# Altium schematic sheet Display.SchDoc: Display
size A4; DrawnBy: Sindre Hovland; Organization: Advanced Wearables Nordic Semi; Revision: V1; SheetNumber: 4; SheetTotal: 4
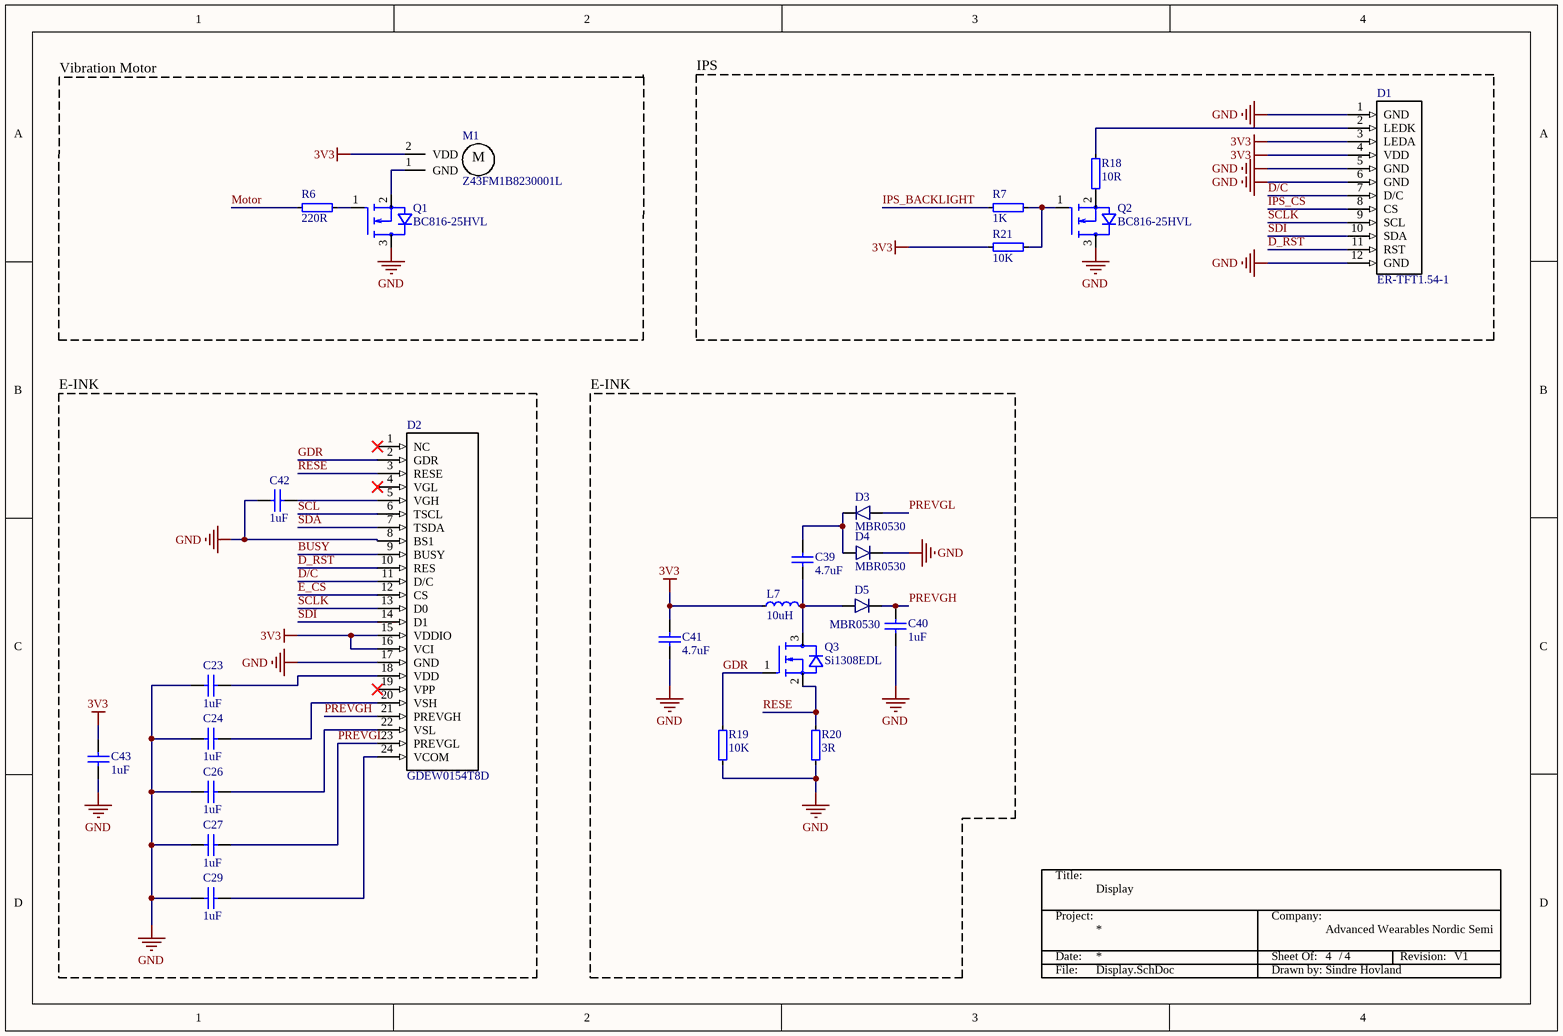
[diagram p0: Display.SchDoc]

## Parts
*  TitleBlock  (value not drawn)  (graphical)
C23  1uF  [C0402]
C24  1uF  [C0402]
C26  1uF  [C0402]
C27  1uF  [C0402]
C29  1uF  [C0402]
C39  4.7uF  [C0402]
C40  1uF  [C0402]
C41  4.7uF  [C0402]
C42  1uF  [C0402]
C43  1uF  [C0402]
D1  ER-TFT1.54-1  [IPS 1.54 inches]
D2  GDEW0154T8D  [E-Papaer 1.54inches]
D3  MBR0530  [SOD-123]
D4  MBR0530  [SOD-123]
D5  MBR0530  [SOD-123]
L7  10uH  [IND0402]
M1  Z43FM1B8230001L  [Z43FM1B8230001L]
Q1  BC816-25HVL  [SOT23-3]
Q2  BC816-25HVL  [SOT23-3]
Q3  Si1308EDL  [SOT323]
R6  220R  [RES0603R]
R7  1K  [RES0402]
R18  10R  [RES0402]
R19  10K  [RES0402]
R20  3R  [RES0402]
R21  10K  [RES0402]

## Blocks framed on the sheet
Vibration Motor: M1 Q1 R6
IPS: D1 Q2 R7 R18 R21
E-INK: C23 C24 C26 C27 C29 C42 C43 D2
E-INK: C39-C41 D3-D5 L7 Q3 R19 R20

## Nets
3V3: C41.1 C43.1 D1.3(LEDA) D1.4(VDD) D2.15(VDDIO) D2.16(VCI) L7.1 M1.2(VDD) R21.1
GND: C23.2 C24.2 C26.2 C27.2 C29.2 C40.2 C41.2 C42.1 C43.2 D1.1(GND) D1.5(GND) D1.6(GND) D1.12(GND) D2.8(BS1) D2.17(GND) D4.2(C) Q1.3(D) Q2.3(D) R19.1 R20.1
BUSY: D2.9(BUSY)
D/C: D1.7(D/C) D2.11(D/C)
D_RST: D1.11(RST) D2.10(RES)
E_CS: D2.12(CS)
GDR: D2.2(GDR) Q3.1(G) R19.2
IPS_BACKLIGHT: R7.1
IPS_CS: D1.8(CS)
Motor: R6.1
PREVGH: C40.1 D2.21(PREVGH) D5.2(C)
PREVGL: C27.1 D2.23(PREVGL) D3.1(A)
RESE: D2.3(RESE) Q3.2(S) R20.2
SCL: D2.6(TSCL)
SCLK: D1.9(SCL) D2.13(D0)
SDA: D2.7(TSDA)
SDI: D1.10(SDA) D2.14(D1)
NetC23_1: C23.1 D2.18(VDD)
NetC24_1: C24.1 D2.20(VSH)
NetC26_1: C26.1 D2.22(VSL)
NetC29_1: C29.1 D2.24(VCOM)
NetC39_1: C39.1 D3.2(C) D4.1(A)
NetC39_2: C39.2 D5.1(A) L7.2 Q3.3(D)
NetC42_2: C42.2 D2.5(VGH)
NetD1_2: D1.2(LEDK) R18.2
NetM1_1: M1.1(GND) Q1.2(S)
NetQ1_1: Q1.1(G) R6.2
NetQ2_1: Q2.1(G) R7.2 R21.2
NetQ2_2: Q2.2(S) R18.1

Not connected (* = marked no-connect by the designer): D2 1(NC)* 4(VGL)* 19(VPP)*

## Notes on the sheet
- (in symbol TitleBlock) Title:; Project:; Company:; Date:; Sheet Of:; /; Revision:; File:; Drawn by:
- (in symbol Vibration Motor) M

## Library data of the parts
C23 C24 C26 C27 C29 C39-C43 = CAP: Capacitor; Value: 100pF; Published: 8-Jun-2000; Revision: July-2002: Re-released for DXP Platform.; Publisher: Altium Limited
D1 = IPS 1.54 inch: IPS display 1.54 inch SPI
D2 = E-Paper 1.54 inch: E-Paper 1.54 inch with integrated driver
D3-D5 = Diode: Switch-mode Schottky / Power Rectifier / 250 V, 40 A
L7 = IND: Inductor; Part Number: FB0402-120R@100M-500mA; Manufacturer: Murata; Manufacturer Part Number: BLM15AG121SN1D; Part number IPS: N.A.; Value: 120R/0.55A; Note: Chip EMIFIL Inductor Type Chip Ferrite Bead; Artikkelnr Noca: 33029317; Footprint Doc: 0402; LatestRevisionDate: 2014-01-10; Pin Count: 2; Publisher: Nordic Semiconductor; Published: 2011-11-14; ComponentLink1URL: *; ComponentLink1Description: Datasheet; ComponentLink2URL: *; ComponentLink2Description: Supplier link; HelpURL: http://search.murata.co.jp/Ceramy/image/img/PDF/ENG/L0110S0100BLM15A_SN.pdf
M1 = Vibration Motor: SMD Vibration Motor / https://www.vibration-motor.com/cylindrical-vibrator-motors/smt-surface-mount-reflow/z43fm1b8230001l; ComponentLink1Description: Manufacturer; ComponentLink1URL: https://www.vibration-motor.com/cylindrical-vibrator-motors/smt-surface-mount-reflow/z43fm1b8230001l
Q1-Q3 = Transistor: N-Channel 20V 100mA _Ta_ 150mW _Ta_ Surface Mount VMT3; MF: Rohm; MP: RUM001L02T2CL; Value: *; SnapEDA_Link: https://www.snapeda.com/parts/RUM001L02T2CL/Rohm/view-part/531428/?ref=snap; Digi-Key_Part_Number: RUM001L02T2CLCT-ND; Digi-Key_Purchase_URL: https://www.digikey.com/product-detail/en/rohm-semiconductor/RUM001L02T2CL/RUM001L02T2CLCT-ND/4571412?utm_source=snapeda&utm_medium=aggregator&utm_campaign=symbol; Package: SOT-723 Rohm
R6 R7 R18-R21 = RES: Resistor, ±5%, 0.05W; Part Number: R0201-0R; Part number IPS: 00000003245; Value: 0R; Note: Chip Res 5%; Artikkelnr Noca: N.A.; Manufacturer: *; Manufacturer Part Number: *; ComponentLink1URL: *; ComponentLink1Description: Datasheet; ComponentLink2URL: *; ComponentLink2Description: Supplier link; HelpURL: *; Footprint Doc: 0201; LatestRevisionDate: 2017-11-09; Pin Count: 2; Publisher: Nordic Semiconductor; Published: 2014-11-13; Supplier 1: *; Supplier Part Number 1: *; Supplier 2: *; Supplier Part Number 2: *